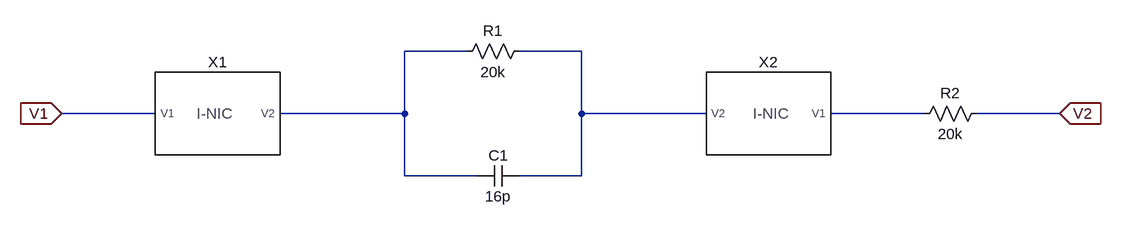
[diagram p0: schematic floating_inductor.asc]
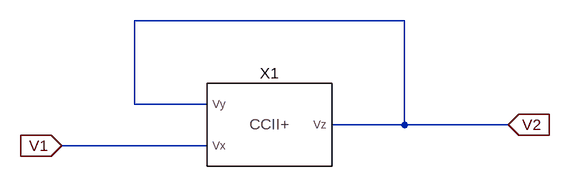
[diagram p1: sub-circuit i-nic.asc]
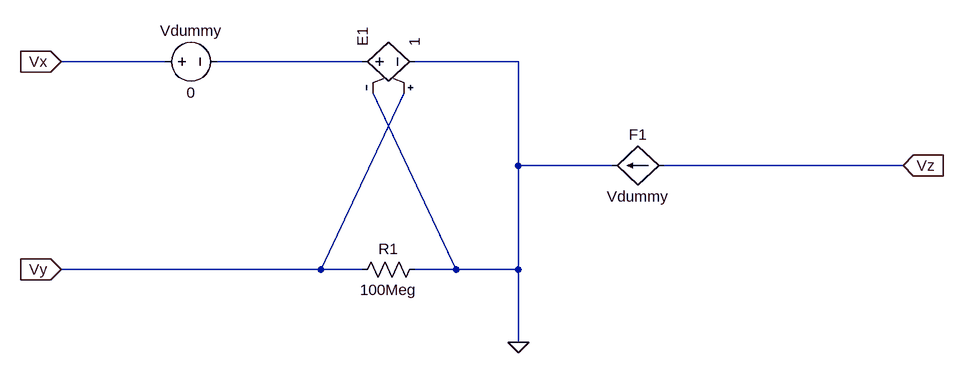
[diagram p2: sub-circuit ccii+.asc]
floating_inductor.asc, the LTspice schematic file:
Version 4
SHEET 1 1512 680
WIRE 432 32 336 32
WIRE 608 32 512 32
WIRE -48 128 -192 128
WIRE 336 128 336 32
WIRE 336 128 144 128
WIRE 608 128 608 32
WIRE 800 128 608 128
WIRE 1136 128 992 128
WIRE 1344 128 1216 128
WIRE 336 224 336 128
WIRE 448 224 336 224
WIRE 608 224 608 128
WIRE 608 224 512 224
FLAG -192 128 V1
IOPIN -192 128 In
FLAG 1344 128 V2
IOPIN 1344 128 In
SYMBOL cap 512 208 R90
WINDOW 0 0 32 VBottom 2
WINDOW 3 32 32 VTop 2
SYMATTR InstName C1
SYMATTR Value 16p
SYMBOL res 528 16 R90
WINDOW 0 0 56 VBottom 2
WINDOW 3 32 56 VTop 2
SYMATTR InstName R1
SYMATTR Value 20k
SYMBOL res 1232 112 R90
WINDOW 0 0 56 VBottom 2
WINDOW 3 32 56 VTop 2
SYMATTR InstName R2
SYMATTR Value 20k
SYMBOL I-NIC 48 128 R0
SYMATTR InstName X1
SYMBOL I-NIC 896 128 M0
SYMATTR InstName X2

i-nic.asc, the sub-circuit schematic file:
Version 4
SHEET 1 880 680
WIRE 416 32 0 32
WIRE 0 160 0 32
WIRE 112 160 0 160
WIRE 416 192 416 32
WIRE 416 192 304 192
WIRE 576 192 416 192
WIRE 112 224 -112 224
FLAG 576 192 V2
IOPIN 576 192 In
FLAG -112 224 V1
IOPIN -112 224 In
SYMBOL CCII+ 208 192 R0
SYMATTR InstName X1

ccii+.asc, the sub-circuit schematic file:
Version 4
SHEET 1 1476 680
WIRE -80 64 -240 64
WIRE 224 64 0 64
WIRE 464 64 304 64
WIRE 464 224 464 64
WIRE 608 224 464 224
WIRE 1056 224 688 224
WIRE 160 384 288 112
WIRE 160 384 -240 384
WIRE 224 384 160 384
WIRE 368 384 240 112
WIRE 368 384 304 384
WIRE 464 384 464 224
WIRE 464 384 368 384
WIRE 464 496 464 384
FLAG -240 64 Vx
IOPIN -240 64 In
FLAG -240 384 Vy
IOPIN -240 384 In
FLAG 1056 224 Vz
IOPIN 1056 224 In
FLAG 464 496 0
SYMBOL voltage -96 64 R270
WINDOW 0 32 56 VTop 2
WINDOW 3 -32 56 VBottom 2
SYMATTR InstName Vdummy
SYMATTR Value 0
SYMBOL f 688 224 R90
WINDOW 0 -32 40 VBottom 2
WINDOW 3 32 40 VTop 2
SYMATTR InstName F1
SYMATTR Value Vdummy
SYMATTR Value2 1
SYMBOL e2 208 64 R270
SYMATTR InstName E1
SYMATTR Value 1
SYMBOL res 320 368 R90
WINDOW 0 0 56 VBottom 2
WINDOW 3 32 56 VTop 2
SYMATTR InstName R1
SYMATTR Value 100Meg

The netlist it stands for:
* floating_inductor.asc
C1 N002 N001 16p
R1 N002 N001 20k
R2 V2 N003 20k
XX1 V1 N001 i-nic
XX2 N003 N002 i-nic

* block symbol definitions
.subckt i-nic V1 V2
XX1 V2 V1 V2 ccii+
.ends i-nic

.subckt ccii+ Vy Vx Vz
Vdummy Vx N001 0
F1 Vz 0 Vdummy 1
E1 N001 0 Vy 0 1
R1 0 Vy 100Meg
.ends ccii+

.backanno
.end